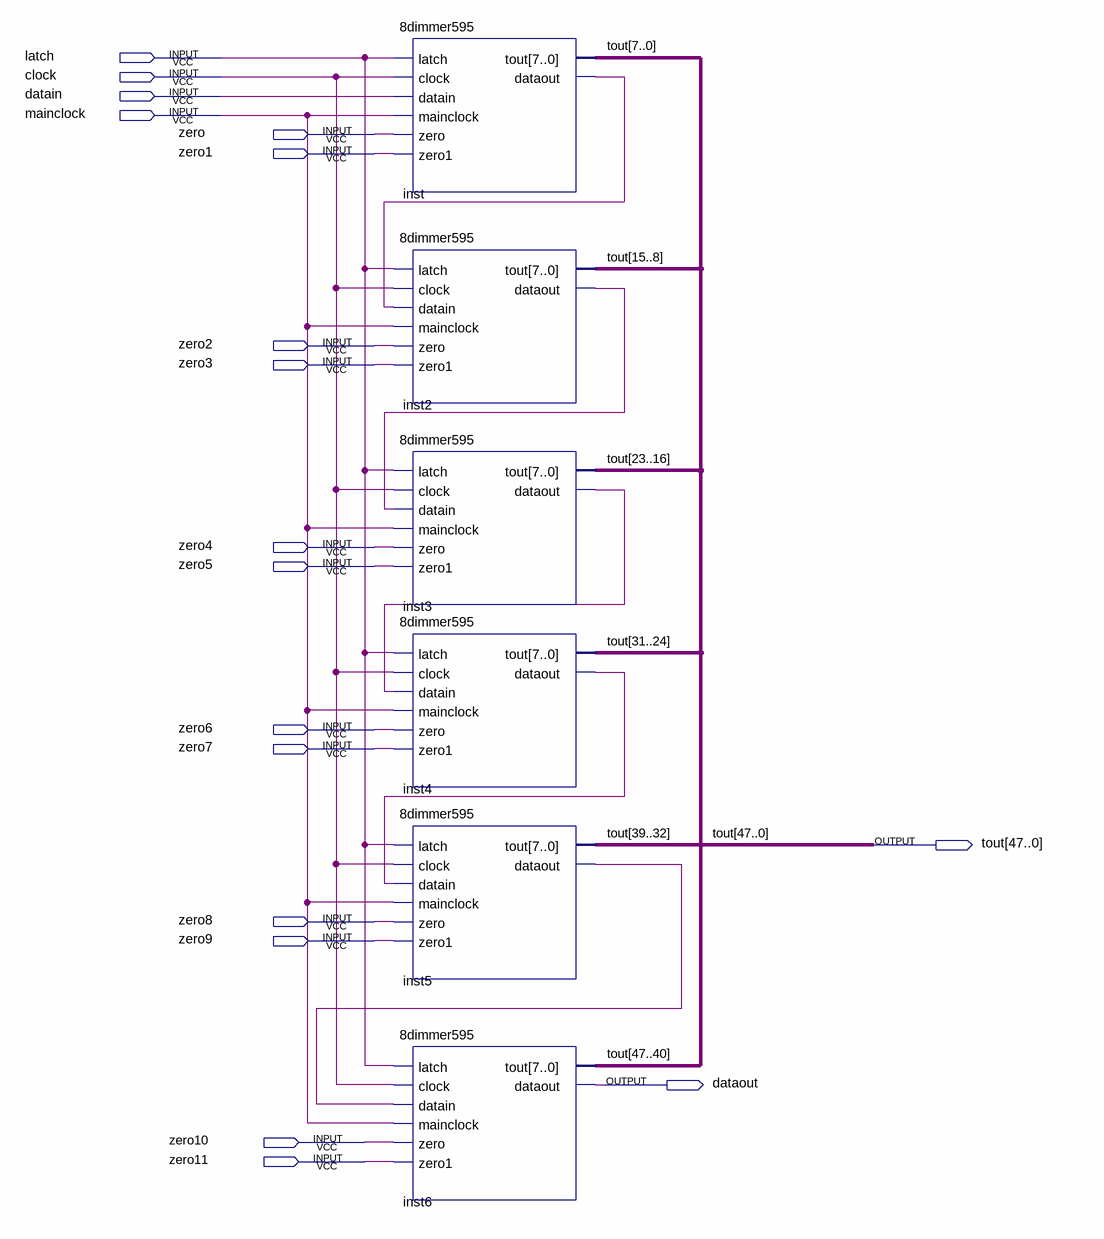
[diagram p0: schematic sheet]
// Quartus schematic 595test.bdf as structural Verilog: 6 symbols, 18 pins
module \595test  (
  input  latch,
  input  clock,
  input  datain,
  input  mainclock,
  input  zero,
  input  zero1,
  input  zero2,
  input  zero3,
  input  zero4,
  input  zero5,
  input  zero6,
  input  zero7,
  input  zero8,
  input  zero9,
  input  zero10,
  input  zero11,
  output [47:0] tout,
  output dataout
);

  wire inst2_dataout, inst3_dataout, inst4_dataout, inst5_dataout, inst_dataout;

  \8dimmer595  inst (
    .latch(latch), .clock(clock), .datain(datain), .mainclock(mainclock), .zero(zero), .zero1(zero1),
    .tout(tout[7:0]), .dataout(inst_dataout));
  \8dimmer595  inst2 (
    .latch(latch), .clock(clock), .datain(inst_dataout), .mainclock(mainclock), .zero(zero2), .zero1(zero3),
    .tout(tout[15:8]), .dataout(inst2_dataout));
  \8dimmer595  inst3 (
    .latch(latch), .clock(clock), .datain(inst2_dataout), .mainclock(mainclock), .zero(zero4), .zero1(zero5),
    .tout(tout[23:16]), .dataout(inst3_dataout));
  \8dimmer595  inst4 (
    .latch(latch), .clock(clock), .datain(inst3_dataout), .mainclock(mainclock), .zero(zero6), .zero1(zero7),
    .tout(tout[31:24]), .dataout(inst4_dataout));
  \8dimmer595  inst5 (
    .latch(latch), .clock(clock), .datain(inst4_dataout), .mainclock(mainclock), .zero(zero8), .zero1(zero9),
    .tout(tout[39:32]), .dataout(inst5_dataout));
  \8dimmer595  inst6 (
    .latch(latch), .clock(clock), .datain(inst5_dataout), .mainclock(mainclock), .zero(zero10),
    .zero1(zero11), .tout(tout[47:40]), .dataout(dataout));
endmodule
